# EAGLE design PCB_ESP (EAGLE 9.7.0)
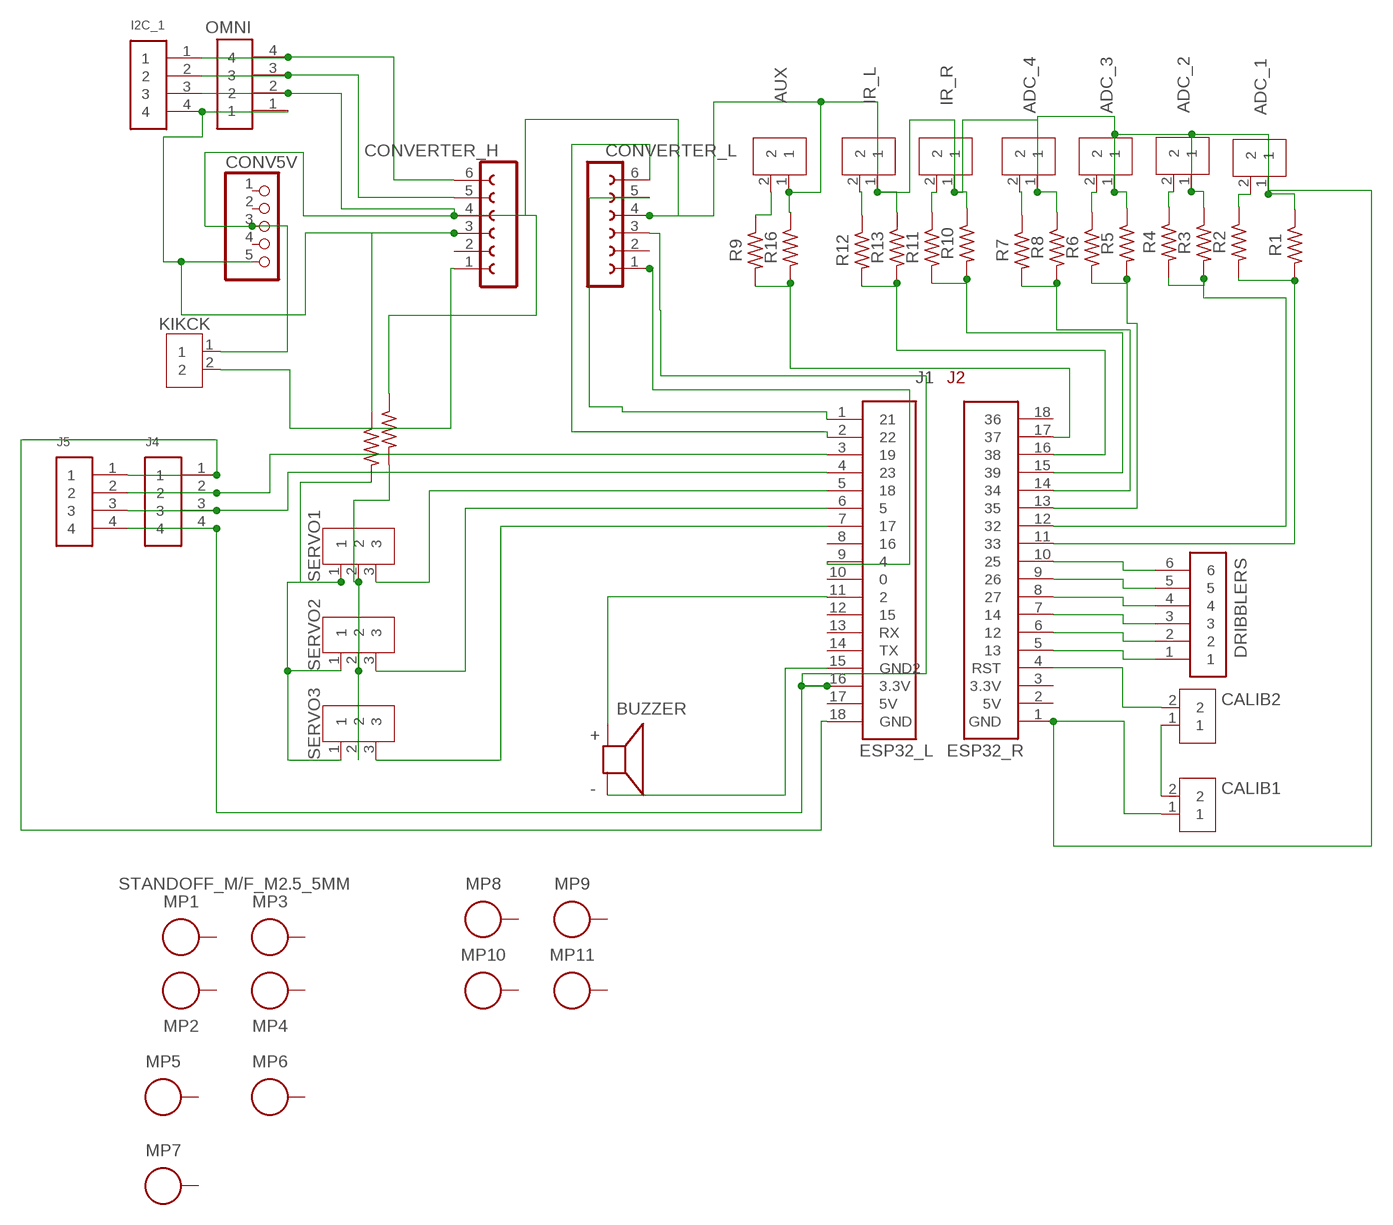
[diagram p0: schematic, sheet 1]

## Parts
ADC_1  2828XX-2282834-2  [TERMBLK_254-2N]
ADC_2  2828XX-2282834-2  [TERMBLK_254-2N]
ADC_3  2828XX-2282834-2  [TERMBLK_254-2N]
ADC_4  2828XX-2282834-2  [TERMBLK_254-2N]
AUX  2828XX-2282834-2  [TERMBLK_254-2N]
BUZZER  AT-1220-TT-9-R  [XDCR_AT-1220-TT-9-R]
CALIB1  2828XX-2282834-2  [TERMBLK_254-2N]
CALIB2  2828XX-2282834-2  [TERMBLK_254-2N]
CONV5V  PINHD-1X55X2MM  [1_05X2MM]
CONVERTER_H  FE06-1  [FE06]
CONVERTER_L  FE06-1  [FE06]
DRIBBLERS  61300611121  [61300611121]
I2C_1  61300411121  [61300411121]
IR_L  2828XX-2282834-2  [TERMBLK_254-2N]
IR_R  2828XX-2282834-2  [TERMBLK_254-2N]
J1  ESP32_L  [61301811121]
J2  ESP32_R  [61301811121]
J4  61300411121  [61300411121]
J5  61300411121  [61300411121]
KIKCK  2828XX-2282834-2  [TERMBLK_254-2N]
MP1  STANDOFF_M/F_M2.5_5MM  [STANDOFF_HEX_MALE-FEMALE_500X500_M2.5X0.45_MTGP755H270]
MP2  STANDOFF_M/F_M2.5_5MM  [STANDOFF_HEX_MALE-FEMALE_500X500_M2.5X0.45_MTGP755H270]
MP3  STANDOFF_M/F_M2.5_5MM  [STANDOFF_HEX_MALE-FEMALE_500X500_M2.5X0.45_MTGP755H270]
MP4  STANDOFF_M/F_M2.5_5MM  [STANDOFF_HEX_MALE-FEMALE_500X500_M2.5X0.45_MTGP755H270]
MP5  STANDOFF_M/F_M2.5_5MM  [STANDOFF_HEX_MALE-FEMALE_500X500_M2.5X0.45_MTGP755H270]
MP6  STANDOFF_M/F_M2.5_5MM  [STANDOFF_HEX_MALE-FEMALE_500X500_M2.5X0.45_MTGP755H270]
MP7  STANDOFF_M/F_M2.5_5MM  [STANDOFF_HEX_MALE-FEMALE_500X500_M2.5X0.45_MTGP755H270]
MP8  STANDOFF_F/F_M2.5_5MM  [STANDOFF_HEX_FEMALE_500X500_M2.5X0.45_MTGP755H270]
MP9  STANDOFF_F/F_M2.5_5MM  [STANDOFF_HEX_FEMALE_500X500_M2.5X0.45_MTGP755H270]
MP10  STANDOFF_F/F_M2.5_5MM  [STANDOFF_HEX_FEMALE_500X500_M2.5X0.45_MTGP755H270]
MP11  STANDOFF_F/F_M2.5_5MM  [STANDOFF_HEX_FEMALE_500X500_M2.5X0.45_MTGP755H270]
OMNI  61300411121  [61300411121]
R1  R-US_AXIAL-7.2MM-PITCH  [RESAD724W46L381D178B]
R2  R-US_AXIAL-7.2MM-PITCH  [RESAD724W46L381D178B]
R3  R-US_AXIAL-7.2MM-PITCH  [RESAD724W46L381D178B]
R4  R-US_AXIAL-7.2MM-PITCH  [RESAD724W46L381D178B]
R5  R-US_AXIAL-7.2MM-PITCH  [RESAD724W46L381D178B]
R6  R-US_AXIAL-7.2MM-PITCH  [RESAD724W46L381D178B]
R7  R-US_AXIAL-7.2MM-PITCH  [RESAD724W46L381D178B]
R8  R-US_AXIAL-7.2MM-PITCH  [RESAD724W46L381D178B]
R9  R-US_AXIAL-7.2MM-PITCH  [RESAD724W46L381D178B]
R10  R-US_AXIAL-7.2MM-PITCH  [RESAD724W46L381D178B]
R11  R-US_AXIAL-7.2MM-PITCH  [RESAD724W46L381D178B]
R12  R-US_AXIAL-7.2MM-PITCH  [RESAD724W46L381D178B]
R13  R-US_AXIAL-7.2MM-PITCH  [RESAD724W46L381D178B]
R14  R-US_AXIAL-7.2MM-PITCH  [RESAD724W46L381D178B]
R15  R-US_AXIAL-7.2MM-PITCH  [RESAD724W46L381D178B]
R16  R-US_AXIAL-7.2MM-PITCH  [RESAD724W46L381D178B]
SERVO1  2828XX-3282834-3  [TERMBLK_254-3N]
SERVO2  2828XX-3282834-3  [TERMBLK_254-3N]
SERVO3  2828XX-3282834-3  [TERMBLK_254-3N]

## Nets
N$1: DRIBBLERS.1 J2.5
N$2: J2.12 R3.2 R4.2
N$3: ADC_2.2 R4.1
N$4: CONVERTER_H.1 KIKCK.2
N$5: CONVERTER_H.6 I2C_1.1 OMNI.4
N$6: J2.14 R7.2 R8.2
N$7: CONVERTER_H.5 I2C_1.2 OMNI.3
N$8: AUX.2 R9.1
N$9: J2.13 R5.2 R6.2
N$11: CONVERTER_L.5 J1.1
N$12: CONVERTER_L.6 J1.2
N$13: ADC_4.2 R7.1
N$14: BUZZER.N J1.15(GND2)
N$15: ADC_3.2 R6.1
N$16: CONV5V.5 CONVERTER_H.3 I2C_1.4 OMNI.1 R14.1
N$17: BUZZER.P J1.11
N$18: ADC_1.1 ADC_2.1 ADC_3.1 ADC_4.1 AUX.1 CALIB1.1 CONV5V.3 CONVERTER_H.4 CONVERTER_L.4 I2C_1.3 IR_L.1 IR_R.1 J2.1(GND) KIKCK.1 OMNI.2 R1.1 R3.1 R5.1 R8.1 R10.1 R13.1 R15.1 R16.1
N$20: CALIB2.2 J2.4(RST)
N$21: DRIBBLERS.2 J2.6
N$22: DRIBBLERS.3 J2.7
N$23: DRIBBLERS.4 J2.8
N$24: DRIBBLERS.5 J2.9
N$25: DRIBBLERS.6 J2.10
N$26: CALIB1.2 CALIB2.1
N$27: ADC_1.2 R2.1
N$29: CONVERTER_L.1 J1.9
N$30: J2.11 R1.2 R2.2
N$31: J2.15 R10.2 R11.2
N$32: IR_L.2 R12.1
N$33: IR_R.2 R11.1
N$34: J1.18(GND) J4.1 J5.1
N$35: J2.17 R9.2 R16.2
N$36: J2.16 R12.2 R13.2
N$37: R14.2 SERVO1.1 SERVO2.1 SERVO3.1
N$38: R15.2 SERVO1.2 SERVO2.2 SERVO3.2
N$40: J1.5 SERVO1.3
N$41: J1.6 SERVO2.3
N$42: J1.7 SERVO3.3
N$43: J1.3 J4.2 J5.2
N$44: J1.4 J4.3 J5.3
N$45: CONVERTER_L.3 J1.16(3.3V) J4.4 J5.4
Unconnected: CONV5V.1 CONV5V.2 CONV5V.4 CONVERTER_H.2 CONVERTER_L.2 J1.8 J1.10 J1.12 J1.13(RX) J1.14(TX) J1.17(5V) J2.2(5V) J2.3(3.3V) J2.18 MP1.1 MP2.1 MP3.1 MP4.1 MP5.1 MP6.1 MP7.1 MP8.1 MP9.1 MP10.1 MP11.1

## Library data of the parts
ADC_1-ADC_4 AUX CALIB1 CALIB2 IR_L IR_R KIKCK = Connector:2828XX-2: 2 Position Wire to Board Terminal Block Horizontal with Board Datasheet <https://www.te.com.cn/commerce/DocumentDelivery/DDEController?Action=showdoc&DocId=Catalog+Section%7F1308389_EUROSTYLE_TERMINAL_BLOCKS%7F0607%7Fpdf%7FEnglish%7FENG_CS_1308389_EUROSTYLE_TERMINAL_BLOCKS_0607.pdf%7F2-282837-5>
BUZZER = Buzzer:AT-1220-TT-9-R: AUDIO TRANSDUCER 3.5 VP-P 85 DB 2048 HZ; MANUFACTURER: PUI Audio; MAXIMUM_PACKAGE_HEIGHT: 8.7 mm; PARTREV: A; STANDARD: Manufacturer Recommendations
CONV5V = Conversor 5V:PINHD-1X5: PIN HEADER; CATEGORY: CONNECTOR; SUB-CATEGORY: PIN-HEADER
CONVERTER_H CONVERTER_L = con-lsta:FE06-1: FEMALE HEADER; OC_FARNELL: unknown; OC_NEWARK: unknown
DRIBBLERS = Header_R_ESP32:61300611121: CONN HEADER VERT 6POS 2.54MM Manufacturer's datasheet <https://katalog.we-online.de/em/datasheet/6130xx11121.pdf>; CREATED_BY: PCBLayout.com; DIGI_KEY_PART_NUMBER: 732-5319-ND; MANUFACTURER: Wurth Electronics Inc.; MPN: 61300611121
I2C_1 J4 J5 OMNI = Header_R_ESP32:61300411121: CONN HEADER VERT 4POS 2.54MM Manufacturer's datasheet <https://katalog.we-online.de/em/datasheet/6130xx11121.pdf>; CREATED_BY: PCBLayout.com; DIGI_KEY_PART_NUMBER: 732-5317-ND; MANUFACTURER: Wurth Electronics Inc.; MPN: 61300411121
J1 = Header_R_ESP32:ESP32_L: CONN HEADER VERT 18POS 2.54MM Manufacturer's datasheet <https://katalog.we-online.de/em/datasheet/6130xx11121.pdf>; CREATED_BY: PCBLayout.com; DIGIKEY_PART_NUMBER: 732-5328-ND; MANUFACTURER: Wurth Electronics Inc.; MPN: 61301811121
J2 = Header_R_ESP32:ESP32_R: CONN HEADER VERT 18POS 2.54MM Manufacturer's datasheet <https://katalog.we-online.de/em/datasheet/6130xx11121.pdf>; CREATED_BY: PCBLayout.com; DIGIKEY_PART_NUMBER: 732-5328-ND; MANUFACTURER: Wurth Electronics Inc.; MPN: 61301811121
MP1-MP7 = PCB-Fasteners_Hardware:STANDOFF_M/F: Male-Male Standoff/Spacer with Mounting pad and hole. Essentra : Male-Female Standoff <https://www.essentracomponents.co.in/index.php?option=com_virtuemart&view=productdetails&virtuemart_product_id=14556> The hole and pad sizes may vary based on the application and type of hardware; always verify the Manufacturer specification or Global Standards.; CATEGORY: Standoff/Spacer; SUB-CATEGORY: Male-Female
MP8-MP11 = PCB-Fasteners_Hardware:STANDOFF_F/F: Female-Female Standoff/Spacer with Mounting pad and hole. Essentra : Female Standoff <https://www.essentracomponents.co.in/index.php?option=com_virtuemart&view=productdetails&virtuemart_product_id=14493> The hole and pad sizes may vary based on the application and type of hardware; always verify the Manufacturer specification or Global Standards.; CATEGORY: Standoff/Spacer; SUB-CATEGORY: Female-Female
R1-R16 = Resistor:R-US: Resistor Fixed - ANSI; CATEGORY: Resistor; SUB-CATEGORY: Fixed
SERVO1-SERVO3 = Connector:2828XX-3: 3 Position Wire to Board Terminal Block Horizontal with Board Datasheet <https://www.te.com.cn/commerce/DocumentDelivery/DDEController?Action=showdoc&DocId=Catalog+Section%7F1308389_EUROSTYLE_TERMINAL_BLOCKS%7F0607%7Fpdf%7FEnglish%7FENG_CS_1308389_EUROSTYLE_TERMINAL_BLOCKS_0607.pdf%7F2-282837-5>; CATEGORY: Connector; DESCRIPTION: TERM BLK 3P SIDE ENT 2.54mm PCB; MANUFACTURER: TE Connectivity; MPN: 282834-3; OPERATING_TEMPERATURE: -40°C to +105°C; PART_STATUS: Active; ROHS_COMPLIANCE: RoHS Compliant; SERIES: 282834; SUBCATEGORY: Terminal Block; TYPE: Side Wire Entry

## Board
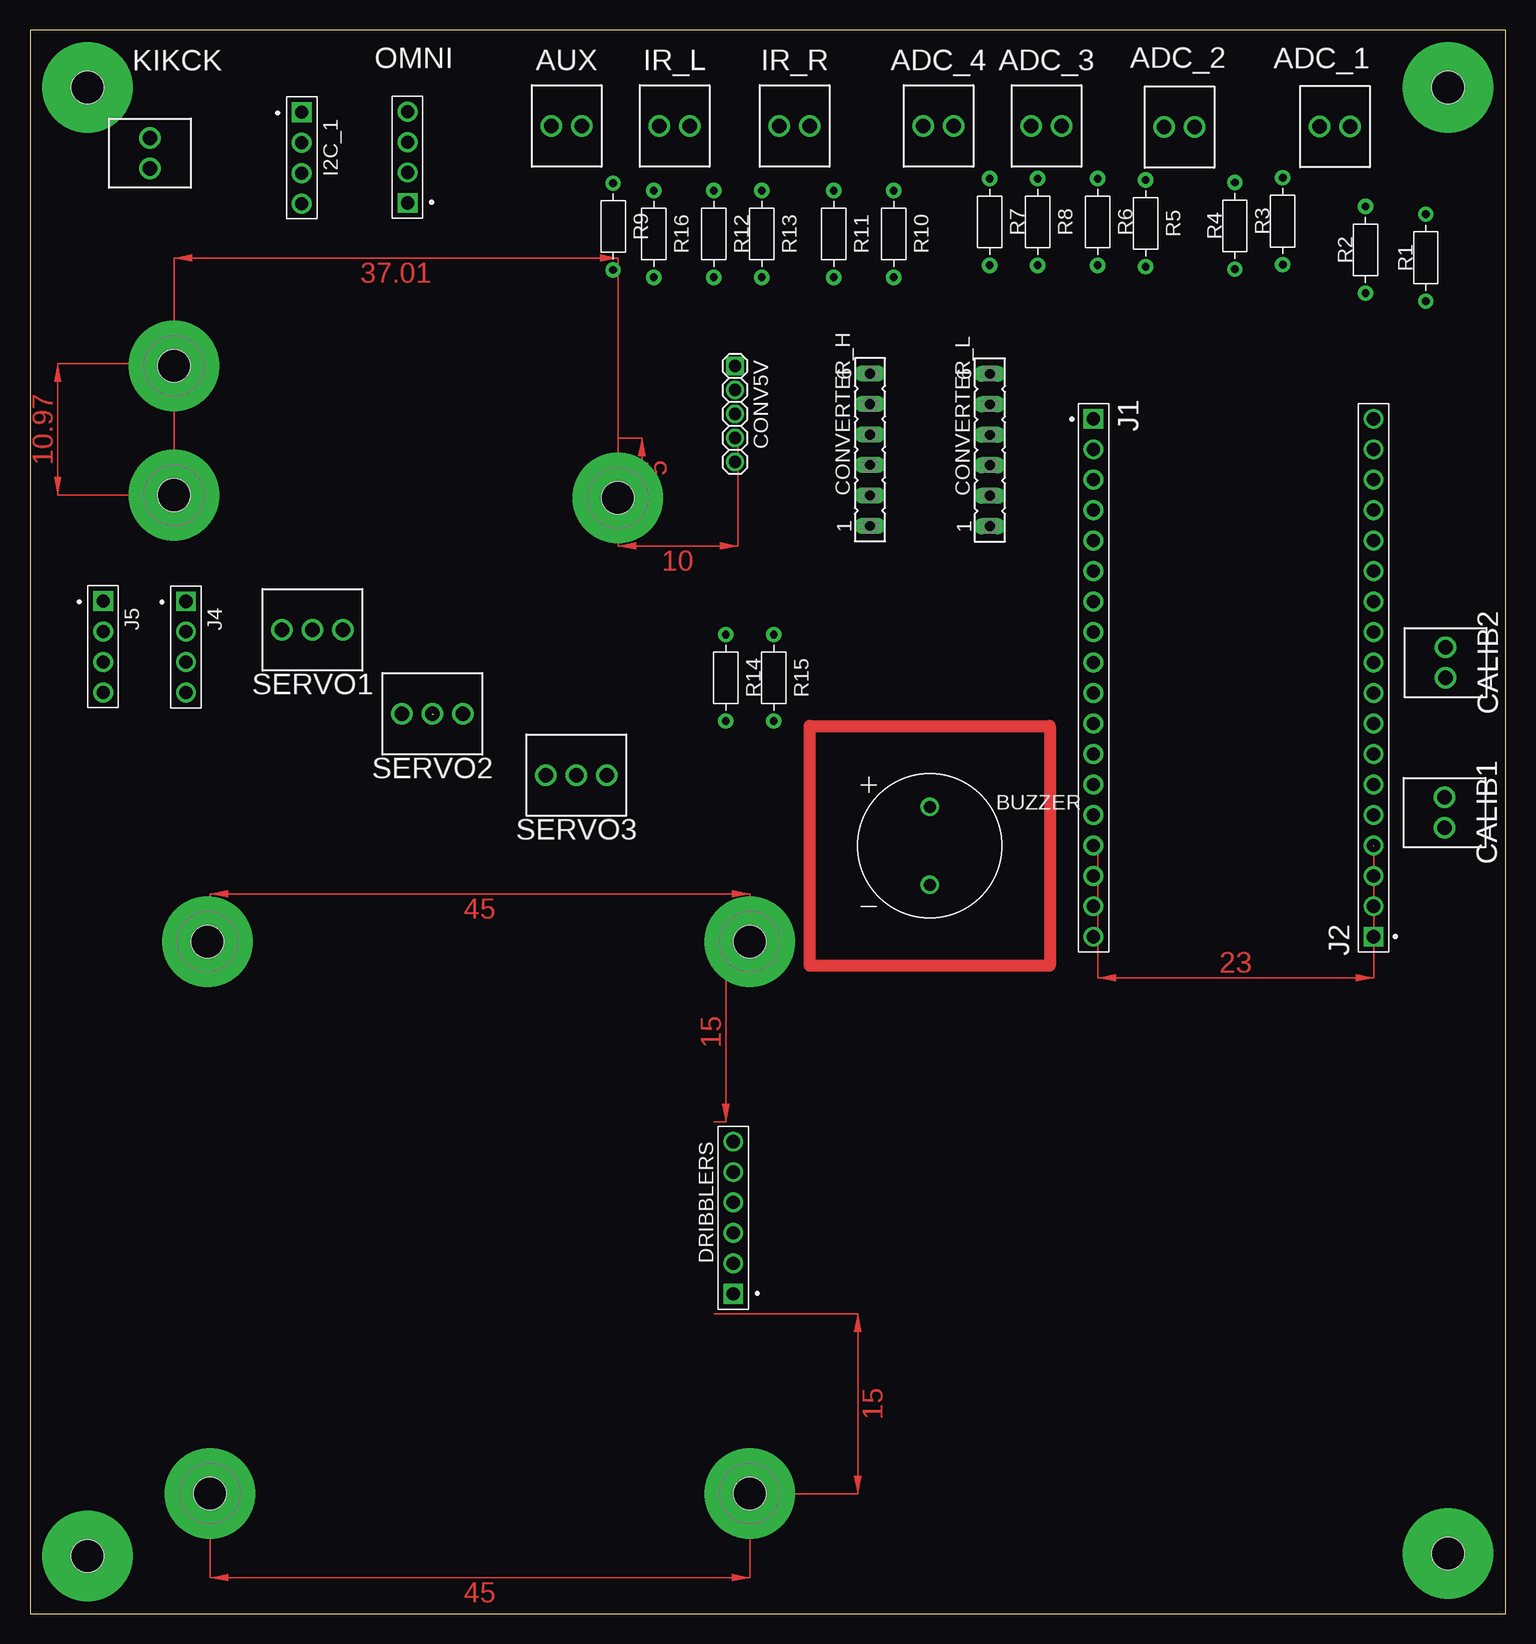
[diagram p1: board, top side]
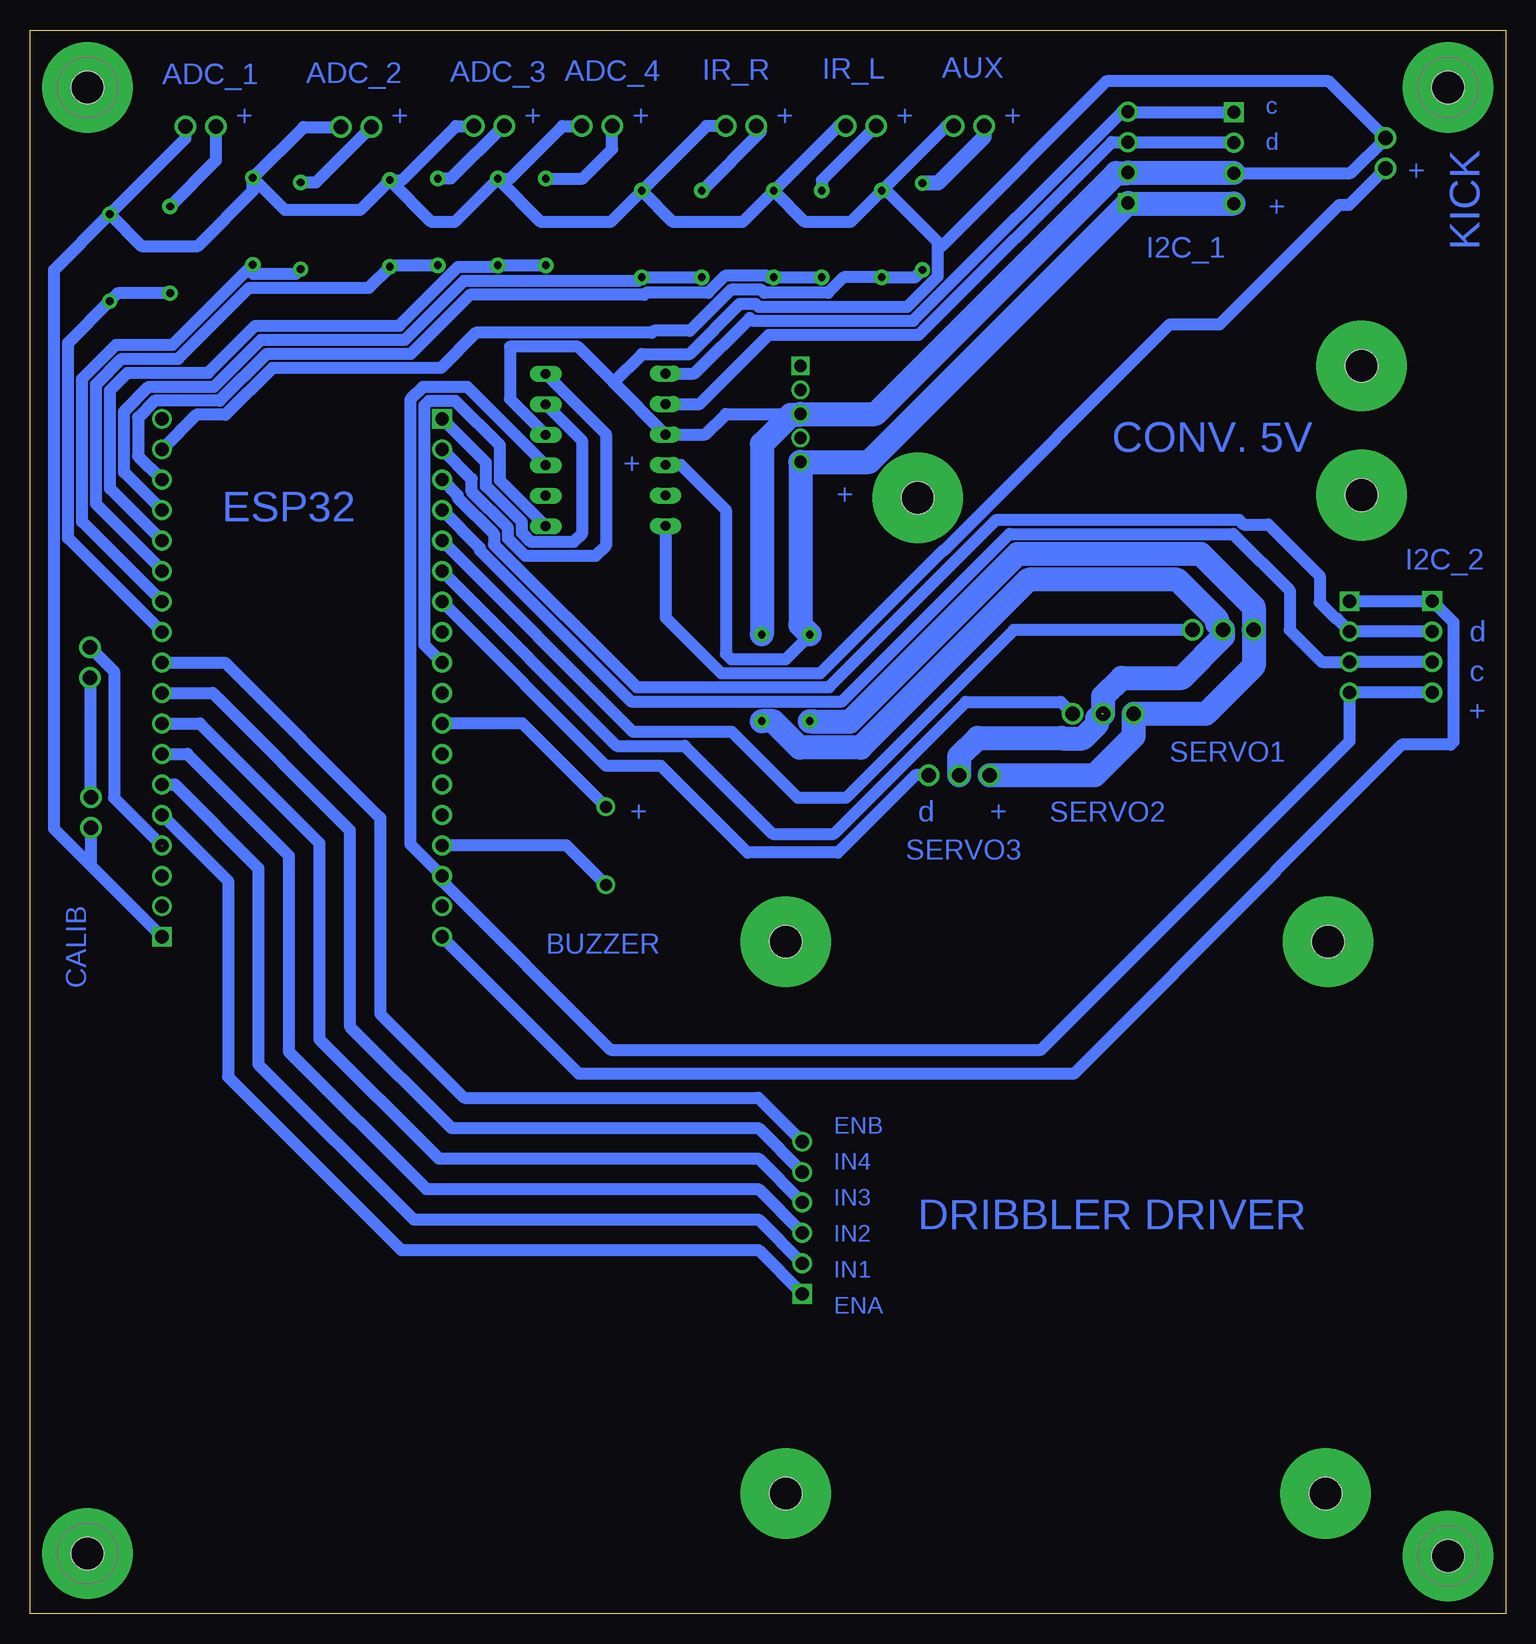
[diagram p2: board, bottom side, seen from below]

Size 123 x 132 mm. Coordinates in mm from the lower left corner, seen from the top.
Outline: 0,132 0,0 123,0 123,132 0,132
Copper layers (1*16): Top 0.035mm / dielectric 1.5mm / Bottom 0.035mm
Design rules "Fusion Electronics Design Rules": minimum track width 6mil, minimum drill 0.35mm, track to track 6mil, track to pad 6mil, pad to pad 6mil, via to via 6mil, smd to smd 6mil, copper to edge 40mil, drill to drill 6mil, minimum pad ring 10mil, minimum via ring 8mil, stop-mask expansion 4mil, vias tented up to drill 0mil, thermal gap 10mil

### Footprints (pad centres in the part's own frame; a part is rotated, then mirrored left to right if it is on the bottom)
TERMBLK_254-2N = drill 1.2: 1 0,0; 2 2.54,0
XDCR_AT-1220-TT-9-R = drill 1: N 0,-3.25; P 0,3.25
1_05X2MM = drill 1.016 pad 1.3 square: 1 -4,0 | drill 1.016 pad 1.3: 2 -2,0; 3 0,0; 4 2,0; 5 4,0
FE06 = drill 0.813 long: 1 -6.35,0; 2 -3.81,0; 3 -1.27,0; 4 1.27,0; 5 3.81,0; 6 6.35,0
61300611121 = drill 1.1 square: 1 -6.35,0 | drill 1.1: 2 -3.81,0; 3 -1.27,0; 4 1.27,0; 5 3.81,0; 6 6.35,0
61300411121 = drill 1.1 square: 1 -3.81,0 | drill 1.1: 2 -1.27,0; 3 1.27,0; 4 3.81,0
61301811121 = drill 1.1 square: 1 -21.59,0 | drill 1.1: 2 -19.05,0; 3 -16.51,0; 4 -13.97,0; 5 -11.43,0; 6 -8.89,0; 7 -6.35,0; 8 -3.81,0; 9 -1.27,0; 10 1.27,0; 11 3.81,0; 12 6.35,0; 13 8.89,0; 14 11.43,0; 15 13.97,0; 16 16.51,0; 17 19.05,0; 18 21.59,0
STANDOFF_HEX_MALE-FEMALE_500X500_M2.5X0.45_MTGP755H270 = drill 2.7 pad 7.55: 1 0,0 | hole 2.7: 0,0
STANDOFF_HEX_FEMALE_500X500_M2.5X0.45_MTGP755H270 = drill 2.7 pad 7.55: 1 0,0 | hole 2.7: 0,0
RESAD724W46L381D178B = drill 0.66 pad 1.26: 1 -3.62,0; 2 3.62,0
TERMBLK_254-3N = drill 1.2: 1 0,0; 2 2.54,0; 3 5.08,0

### Placement (x,y rotation side)
ADC_1  110.05,123.95 180 top
ADC_2  97.09,123.91 180 top
ADC_3  86,124 180 top
ADC_4  77,124 180 top
AUX  46,124 180 top
BUZZER  75,64 0 top
CALIB1  117.92,65.5 90 top
CALIB2  118,78 90 top
CONV5V  58.78,100 270 top
CONVERTER_H  70.02,97.01 90 top
CONVERTER_L  80.01,96.99 90 top
DRIBBLERS  58.63,32.99 90 top
I2C_1  22.65,121.34 270 top
IR_L  55,124 180 top
IR_R  65,124 180 top
J1  88.65,78 270 top
J2  112,78 90 top
J4  13,80.57 270 top
J5  6.1,80.59 270 top
KIKCK  10,123 270 top
MP1  60,10 0 top
MP2  60,56 0 top
MP3  15,10 0 top
MP4  14.79,56 0 top
MP5  49.01,93 0 top
MP6  12,93.23 0 top
MP7  12,104 0 top
MP8  4.79,127.21 0 bottom
MP9  118.21,127.21 0 bottom
MP10  4.79,4.79 0 bottom
MP11  118.21,5 0 bottom
OMNI  31.47,121.39 90 top
R1  116.35,113.01 270 top
R2  111.33,113.67 270 top
R3  104.42,116.07 270 top
R4  100.44,115.67 270 top
R5  93,115.88 270 top
R6  89,116 270 top
R7  80,116 270 top
R8  84,116 270 top
R9  48.62,115.62 270 top
R10  72,115 270 top
R11  67,115 270 top
R12  57,115 270 top
R13  61,115 270 top
R14  58,78 270 top
R15  62,78 270 top
R16  52,115 270 top
SERVO1  21,82 0 top
SERVO2  31,75 0 top
SERVO3  43,69.89 0 top

### Tracks (layer width: path | path; a pad name or v marks a point on that pad's centre or on a via)
N$1
  Bottom 1.016: J2.5 106.5,61.07 106.5,44.74 92.06,30.3 62.29,30.3 DRIBBLERS.1
N$2
  Bottom 1.016: R4.2 100.82,111.67 104.42,111.67 R3.2 111.11,105.76 115.83,105.76 118.66,102.93 118.66,91.01 J2.12
N$3
  Bottom 1.016: R4.1 99.17,119.29 ADC_2.2
N$4
  Bottom 1.016: CONVERTER_H.1 70.02,83.02 65.38,78.38 57.12,78.38 46.94,88.56 46.87,88.56 27.98,107.46 23.81,107.46 13.84,117.44 13.03,117.44 KIKCK.2
N$5
  Bottom 1.016: CONVERTER_H.6 67.64,103.36 63,108 62.75,107.75 49.39,107.75 31.94,125.2 OMNI.4 31.42,125.15 I2C_1.1
N$6
  Bottom 1.016: R7.2 R8.2 84.12,112.26 87.3,112.26 92.22,107.34 104.23,107.34 108.14,103.42 114.86,103.42 116.33,101.96 116.33,93.76 J2.14
N$7
  Bottom 1.016: CONVERTER_H.5 67.18,100.82 61.42,106.58 48.9,106.58 32.83,122.66 OMNI.3 22.7,122.66 I2C_1.2
N$8
  Bottom 1.27: AUX.2 43.46,123.08 47.3,119.24 R9.1
N$9
  Bottom 1.016: J2.13 112,87 117.5,92.5 117.5,102.44 115.35,104.59 110.63,104.59 104.71,110.5 94.75,110.5 R5.2 92.88,112.38 R6.2
N$11
  Bottom 1.016: CONVERTER_L.5 77,97.79 77,90 77.68,89.32 81.22,89.32 82,90.09 82,90.97 85,93.97 85,95.94 J1.1
N$12
  Bottom 1.016: CONVERTER_L.6 75,98.33 75,89 75.85,88.15 81.7,88.15 83.16,89.61 83.16,90.48 86.17,93.49 86.17,94.57 J1.2
N$13
  Bottom 1.016: R7.1 76.92,119.62 74.46,122.08 ADC_4.2
N$14
  Bottom 1.016: BUZZER.N 78.28,64.03 J1.15
N$15
  Bottom 1.016: ADC_3.2 83.54,124 87.92,119.62 R6.1
N$16
  Bottom 1.016: CONVERTER_H.3 68.74,95.74 65,92 65,80 64.55,79.55 60,79.55 58,81.55 R14.1
  Bottom 2: R14.1 58.78,82.4 CONV5V.5 53.05,96 OMNI.1 31.42,117.53 I2C_1.4
N$17
  Bottom 1.016: BUZZER.P 81.94,74.19 J1.11
N$18
  Bottom 1.016: 74.37,102.63 CONVERTER_H.4 66.72,98.28 65,100 CONV5V.3 | 74.37,102.63 77.32,105.58 83,105.58 83,101.25 CONVERTER_L.4 | 74.37,102.63 72,105 68,105 63.83,109.17 62.52,109.17 62.27,108.92 49.87,108.92 47.33,111.46 47.33,114.33 | 47.33,114.33 47,114 33.29,127.71 14.71,127.71 KIKCK.1 12.93,120.07 I2C_1.3 | 47.33,114.33 51.62,118.62 R16.1 | AUX.1 46.62,124 R16.1 | R16.1 54.62,116 58.38,116 R13.1 | R13.1 63.62,116 69.38,116 R10.1 | IR_R.1 66.62,124 R10.1 | IR_L.1 55.62,124 R13.1 | R10.1 74.62,116 80.38,116 R8.1 | R8.1 83,119.62 78.62,124 ADC_4.1 | R8.1 87.62,116 89.5,116 R5.1 | R5.1 92,119.5 87.5,124 ADC_3.1 | R5.1 95.5,117 101.73,117 R3.1 | J2.1 117.92,62.33 | 117.92,62.33 CALIB1.1 | 117.92,62.33 121,65.41 121,112 116.37,116.63 | 116.37,116.63 R1.1 113.72,114 109,114 104.42,118.58 R3.1 | ADC_1.1 110.05,122.95 116.37,116.63 | R3.1 100.2,123.91 ADC_2.1
  Bottom 2: R15.1 62,97.48 59.57,99.91 58.86,99.91 CONV5V.3 52.52,100 32.46,120.07 31.42,120.07 | I2C_1.3 31.42,120.07 | 31.42,120.07 OMNI.2
N$19
  Top 1.016: 85,54 65,54 65,74 85,74 85,54
N$20  (1 unrouted)
  Bottom 1.016: CALIB2.2 116,78.54 116,68 112,64
N$21
  Bottom 1.016: J2.6 110.95,69.11 103.96,62.12 103.96,45.79 91.01,32.84 62.29,32.84 DRIBBLERS.2
N$22
  Bottom 1.016: J2.7 109.9,71.65 101.42,63.17 101.42,46.84 89.96,35.38 62.29,35.38 DRIBBLERS.3
N$23
  Bottom 1.016: J2.8 108.84,74.19 98.88,64.23 98.88,47.9 88.9,37.92 62.29,37.92 DRIBBLERS.4
N$24
  Bottom 1.016: J2.9 107.79,76.73 96.34,65.28 96.34,48.95 87.85,40.46 62.29,40.46 DRIBBLERS.5
N$25
  Bottom 1.016: J2.10 106.74,79.27 93.8,66.33 93.8,50 86.8,43 62.29,43 DRIBBLERS.6
N$26
  Bottom 1.016: CALIB2.1 118,68.12 CALIB1.2
N$27
  Bottom 1.016: ADC_1.2 107.51,121.11 R2.1
N$29
  Bottom 1.016: CONVERTER_L.1 83.83,94.46 83.83,97.36 87.55,101.08 89.75,101.08 90.13,100.69 90.13,80.75 J1.9
N$30
  Bottom 1.016: R2.2 115.69,110.05 R1.2 119.83,105.91 119.83,89.64 J2.11
N$31
  Bottom 1.016: R11.2 R10.2 72.29,111.09 86.81,111.09 91.73,106.17 103.74,106.17 107.66,102.25 113.09,102.25 115.16,100.19 115.16,95.13 J2.15
N$32
  Bottom 1.016: IR_L.2 57,119.46 R12.1
N$33
  Bottom 1.016: IR_R.2 62.07,123.61 62.07,123.55 R11.1
N$34
  Bottom 1.016: J1.18 77.24,45 36,45 19.23,61.77 19.23,61.84 8.63,72.44 4.56,72.44 4.34,72.66 4.34,82.65 J5.1 6.12,84.38 J4.1
N$35
  Bottom 1.016: J2.17 109.13,99.92 106.69,99.92 102.78,103.83 88.77,103.83 85.84,106.75 71.15,106.75 70.98,106.92 67.98,106.92 64.57,110.34 62.03,110.34 61.78,110.09 56.47,110.09 55.17,111.38 R16.2 49.24,111.38 R9.2
N$36
  Bottom 1.016: R12.2 R13.2 61.42,111.38 61.55,111.5 65.05,111.5 66.47,110.09 71.64,110.09 71.81,109.92 86.33,109.92 91.25,105 103.26,105 107.17,101.09 112.61,101.09 113.99,99.7 113.99,96.5 J2.16
N$37
  Bottom 2: SERVO3.1 34.25,69.89 31,73.13 SERVO2.1 25,75 21,79 SERVO1.1 21,83.92 25.42,88.34 40.66,88.34 54.66,74.34 57.69,74.34 57.73,74.38 R14.2
N$38  (1 unrouted)
  Bottom 2: R15.2 61.04,74.38 58.85,72.19 53.77,72.19 39.77,86.19 27.37,86.19 24.03,82.85 24.03,82.49 SERVO1.2 23.54,81.46 27,78 32,78 33.54,76.46 SERVO2.2 | SERVO3.2 45.54,71.46 44,73 36.98,73 36.93,72.95 35.23,72.95 34.03,74.15 34.03,74.61 33.64,75
N$40
  Bottom 1.016: SERVO1.3 41,82 55,68 59,68 64.5,73.5 72.71,73.5 J1.5
N$41
  Bottom 1.016: SERVO2.3 37.08,76 45,76 56,65 61.1,65 68.42,72.33 74.08,72.33 J1.6
N$42
  Bottom 1.016: J1.7 74.96,70.66 70.41,70.66 63.19,63.44 55.65,63.44 49.2,69.89 SERVO3.3
N$43
  Bottom 1.016: J1.3 87.34,93.2 87.34,93.01 84.33,90 84.33,89.12 72.42,77.21 56.38,77.21 42.42,91.17 22.21,91.17 21.84,90.79 19.79,90.79 15.48,86.48 15.48,84.28 14.1,82.9 14.02,82.9 12.98,81.86 | J5.2 12.98,81.86 | 12.98,81.86 J4.2
N$44
  Bottom 1.016: J1.4 85.5,88.82 85.5,88.64 72.9,76.04 55.31,76.04 41.35,90 22.7,90 18,85.3 18,82 15.32,79.32 12.98,79.32 | J5.3 12.98,79.32 | 12.98,79.32 J4.3
N$45
  Bottom 1.016: CONVERTER_L.3 86.54,102.24 90.23,102.24 91.3,101.17 91.3,64.14 J1.16 88.65,61.05 74.6,47 38.72,47 13,72.72 J4.4 12.98,76.78 J5.4
(copper drawn outside any net)
  shapes: Top area x9

### Text on the board
Bottom: AUX | IR_L | IR_R | ADC_4 | ADC_3 | ADC_2 | ADC_1 | c | + | + | + | + | + | + | + | KICK | d | + | + | I2C_1 | CONV. 5V | + | + | ESP32 | I2C_2 | d | c | + | SERVO1 | SERVO2 | + | d | + | SERVO3 | CALIB | BUZZER | ENB | IN4 | IN3 | DRIBBLER DRIVER | IN2 | IN1 | ENA